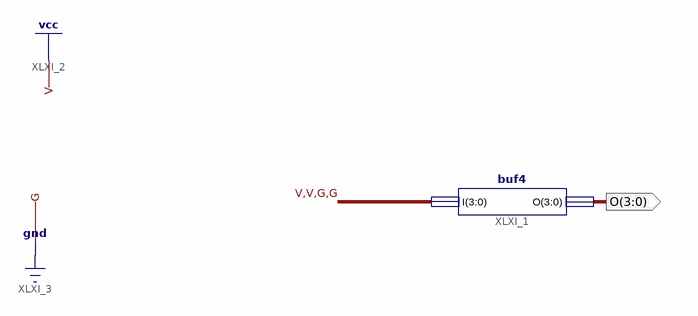
[diagram p0: schematic sheet 1]
// Xilinx ISE schematic constant12fourbit.sch (spartan3adsp) as structural Verilog: 1 symbols, 1 ports
module constant12fourbit (
  output [3:0] O
);

  buf4 XLXI_1 (.I(4'b1100), .O(O));
endmodule
